# EAGLE design flight controller with pcb frame (EAGLE 9.3.2)
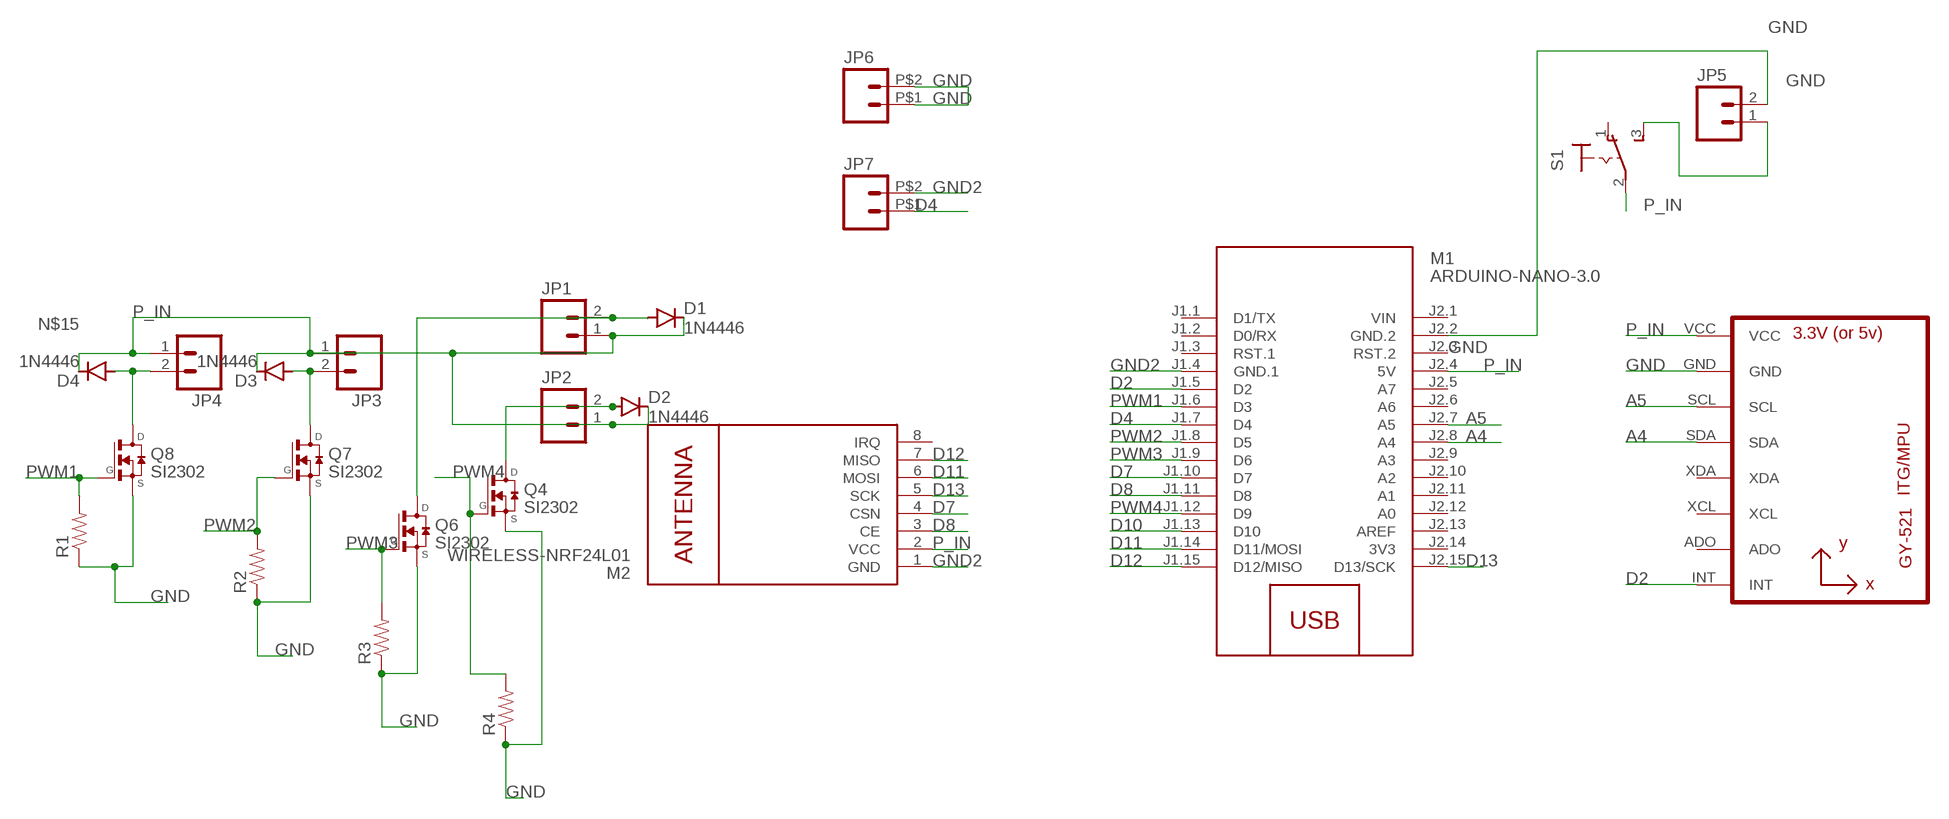
[diagram p0: schematic, sheet 1]

## Parts
D1  1N4446  [DO35-10]
D2  1N4446  [DO35-10]
D3  1N4446  [DO35-10]
D4  1N4446  [DO35-10]
JP1  M021X02_NO_SILK  [1X02_NO_SILK]
JP2  M021X02_NO_SILK  [1X02_NO_SILK]
JP3  M021X02_NO_SILK  [1X02_NO_SILK]
JP4  M021X02_NO_SILK  [1X02_NO_SILK]
JP5  M02PTH  [1X02]
JP6  M02PTH2  [1X02_BIG]
JP7  M02PTH2  [1X02_BIG]
M1  ARDUINO-NANO-3.0  [ARDUINO-NANO-3.0]
M2  WIRELESS-NRF24L01  [WIRELESS-NRF24L01]
Q4  SI2302  [SOT23]
Q6  SI2302  [SOT23]
Q7  SI2302  [SOT23]
Q8  SI2302  [SOT23]
R1  RESISTORAXIAL-0.3  [AXIAL-0.3]
R2  RESISTORAXIAL-0.3  [AXIAL-0.3]
R3  RESISTORAXIAL-0.3  [AXIAL-0.3]
R4  RESISTORAXIAL-0.3  [AXIAL-0.3]
S1  M9040P  [M9040P]
U1  GY-521MPU6050  [GY-521]

## Nets
A4: M1.J2.8(A4) U1.SDA
A5: M1.J2.7(A5) U1.SCL
D2: M1.J1.5(D2) U1.INT
D4: JP7.P$1 M1.J1.7(D4)
D7: M1.J1.10(D7) M2.4(CSN)
D8: M1.J1.11(D8) M2.3(CE)
D10: M1.J1.13(D10)
D11: M1.J1.14(D11/MOSI) M2.6(MOSI)
D12: M1.J1.15(D12/MISO) M2.7(MISO)
D13: M1.J2.15(D13/SCK) M2.5(SCK)
GND: JP5.2 JP6.P$1 JP6.P$2 M1.J2.2(GND.2) Q4.2(S) Q6.2(S) Q7.2(S) Q8.2(S) R1.P$1 R2.P$1 R3.P$1 R4.P$1 U1.GND
GND2: JP7.P$2 M1.J1.4(GND.1) M2.1(GND)
N$2: JP5.1 S1.3(S)
N$12: D1.A JP1.2 Q6.3(D)
N$13: D3.A JP3.2 Q7.3(D)
N$14: D2.A JP2.2 Q4.3(D)
N$15: D4.A JP4.2 Q8.3(D)
P_IN: D1.C D2.C D3.C D4.C JP1.1 JP2.1 JP3.1 JP4.1 M1.J2.4(5V) M2.2(VCC) S1.2(P) U1.VCC
PWM1: M1.J1.6(D3) Q8.1(G) R1.P$2
PWM2: M1.J1.8(D5) Q7.1(G) R2.P$2
PWM3: M1.J1.9(D6) Q6.1(G) R3.P$2
PWM4: M1.J1.12(D9) Q4.1(G) R4.P$2
Unconnected: M1.J1.1(D1/TX) M1.J1.2(D0/RX) M1.J1.3(RST.1) M1.J2.3(RST.2) M1.J2.5(A7) M1.J2.6(A6) M1.J2.9(A3) M1.J2.10(A2) M1.J2.11(A1) M1.J2.12(A0) M1.J2.13(AREF) M2.8(IRQ) S1.1(O) U1.ADO U1.XCL U1.XDA

## Power pins joined to a net without a drawn wire
3V3: M1.J2.14(3V3)
VIN: M1.J2.1(VIN)

## Library data of the parts
D1-D4 = diode:1N4446: DIODE high speed (Philips)
JP1-JP7 = SparkFun:M02: Header 2 Standard 2-pin 0.1" header. Use with straight break away headers (SKU : PRT-00116), right angle break away headers (PRT-00553), swiss pins (PRT-00743), machine pins (PRT-00117), and female headers (PRT-00115). Molex polarized connector foot print use with SKU : PRT-08233 with associated crimp pins and housings.
M1 = diy-modules:ARDUINO-NANO-3.0: Arduino Nano 3.0 and compatible devices More details available here: https://www.arduino.cc/en/Main/ArduinoBoardNano Click here to find device on ebay.com <http://www.ebay.com/sch/arduino+nano>
M2 = diy-modules:WIRELESS-NRF24L01: 2.4 GHz Wireless Module based on NRF24L01 chip More details available here: http://www.electrodragon.com/w/NRF24L01 Click here to find device on ebay.com <http://www.ebay.com/sch/nrf24l01+arduino>
Q4 Q6-Q8 = transistor-fet:SI2302: MOSFET N-Channel 20 V (D-S)
R1-R4 = SparkFun:RESISTOR: Resistor Basic schematic elements and footprints for 0603, 1206, and PTH resistors.
S1 = switch:M9040P: TOGGLE SWITCH Marquardt
U1 = gy-521:GY-521

## Board
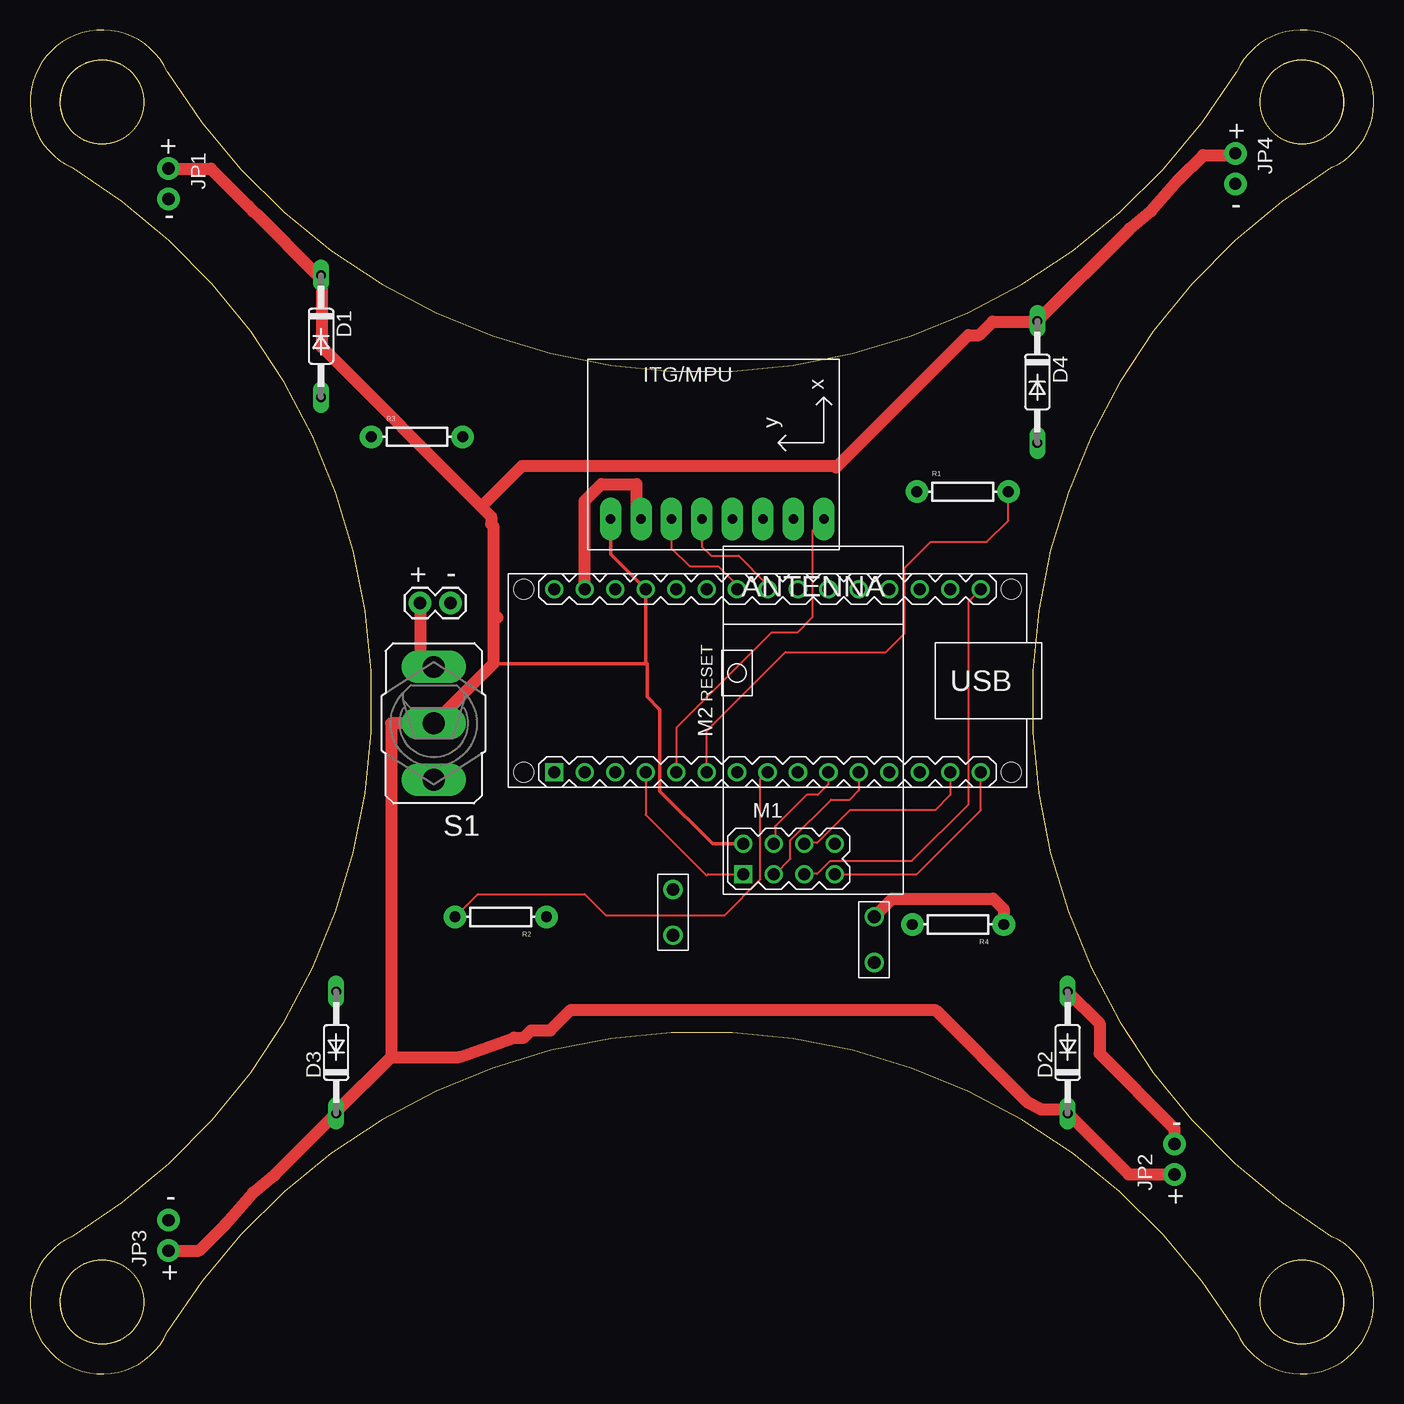
[diagram p1: board, top side]
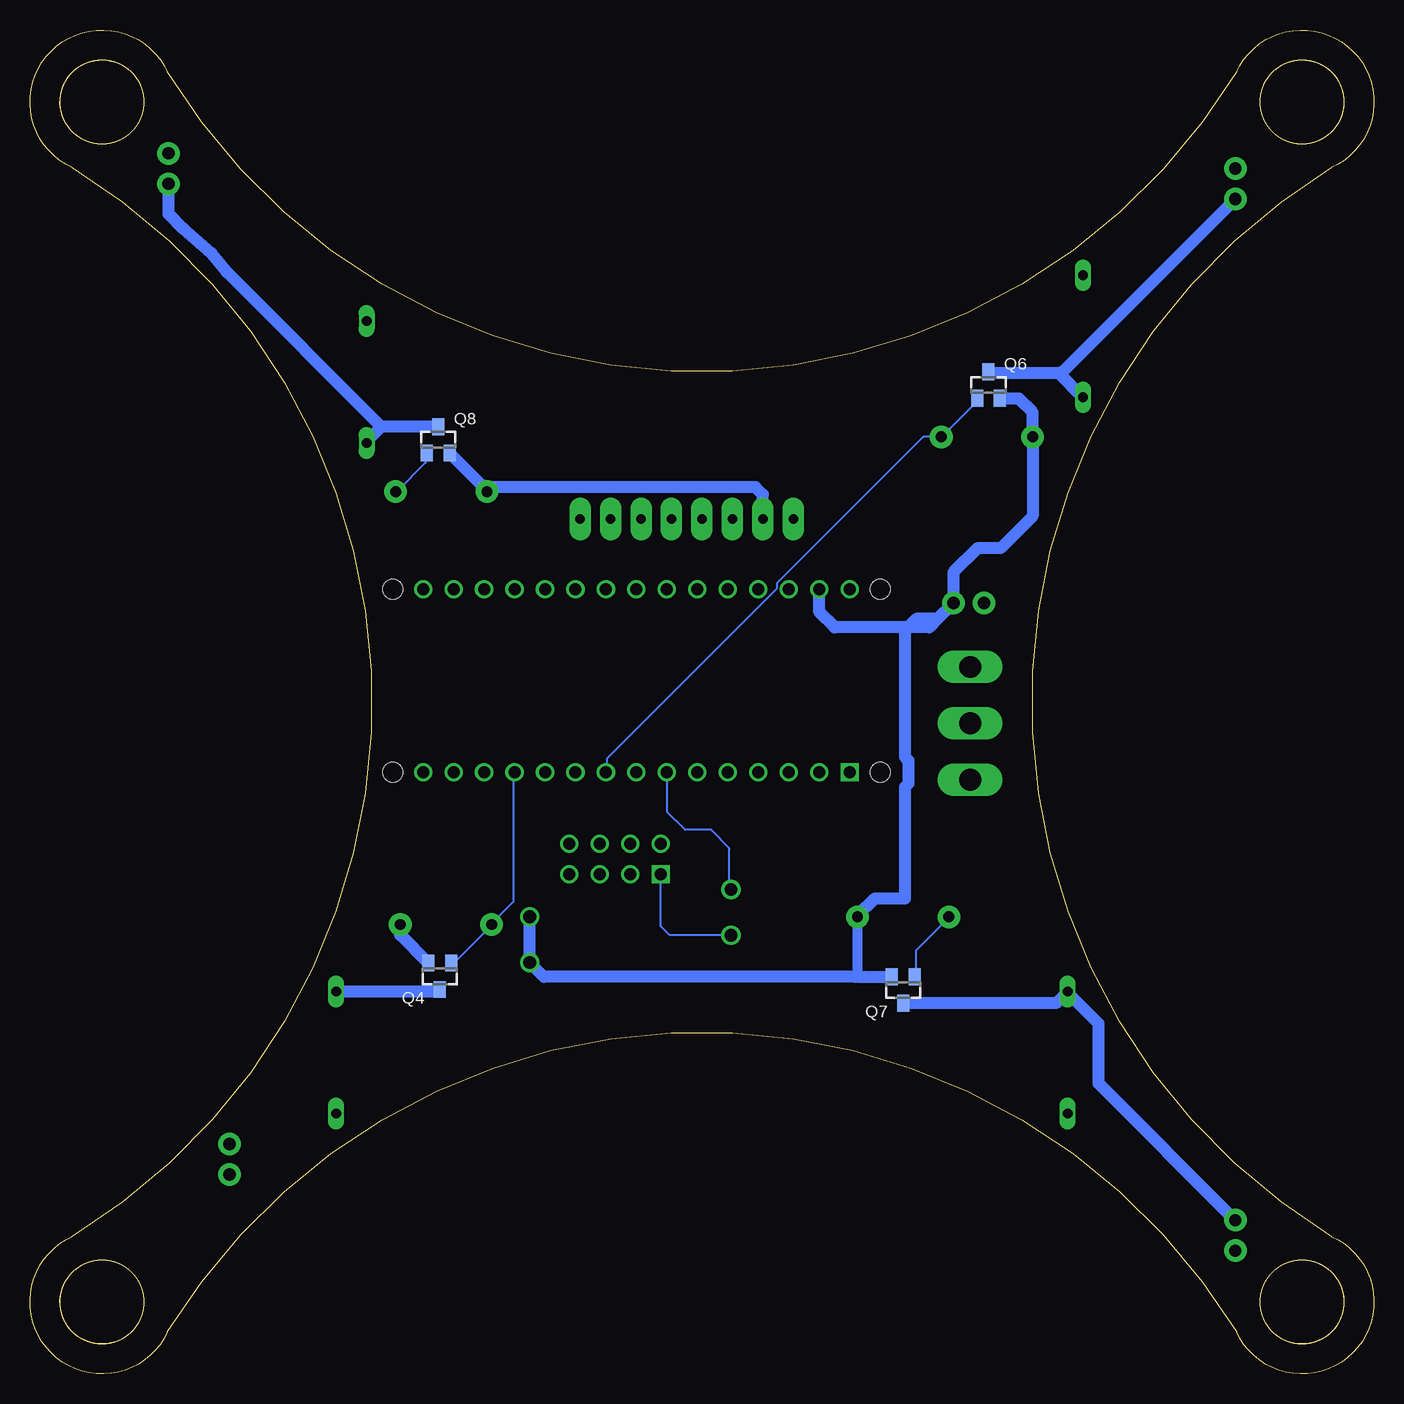
[diagram p2: board, bottom side, seen from below]

Size 112 x 112 mm. Coordinates in mm from the lower left corner, seen from the top.
Outline: 11.45,108.5 arc221 3.5,100.54
Outline: 9.18,107.46 arc221 4.54,102.82
Outline: 108.5,100.54 arc221 100.54,108.5
Outline: 107.46,102.82 arc221 102.82,107.46
Outline: 100.54,3.5 arc221 108.5,11.45
Outline: 102.82,4.54 arc221 107.46,9.18
Outline: 3.5,11.45 arc221 11.45,3.5
Outline: 4.54,9.18 arc221 9.18,4.54
Outline: 11.45,108.5 arc117 100.54,108.5
Outline: 108.5,100.54 arc221 100.54,108.5
Outline: 108.5,100.54 arc117 108.5,11.45
Outline: 3.5,11.45 arc117 3.5,100.54
Outline: 11.45,108.5 arc221 3.5,100.54
Outline: 100.54,3.5 arc221 108.5,11.45
Outline: 100.54,3.5 arc117 11.45,3.5
Outline: 3.5,11.45 arc221 11.45,3.5
Outline: circle at 6.37,102.52 radius 0
Outline: circle at 106,106 radius 3.5
Outline: circle at 6,106 radius 3.5
Outline: circle at 106,6 radius 3.5
Outline: circle at 6,6 radius 3.5
Copper layers (1*16): Top 0.035mm / dielectric 1.5mm / Bottom 0.035mm
Design rules "default": minimum track width 6mil, minimum drill 0.35mm, track to track 6mil, track to pad 6mil, pad to pad 6mil, via to via 6mil, smd to smd 6mil, copper to edge 40mil, drill to drill 6mil, minimum pad ring 10mil, minimum via ring 8mil, stop-mask expansion 4mil, vias tented up to drill 0mil, thermal gap 10mil

### Footprints (pad centres in the part's own frame; a part is rotated, then mirrored left to right if it is on the bottom)
DO35-10 = drill 0.813 long: A 5.08,0; C -5.08,0
1X02_NO_SILK = drill 1.016 pad 1.88: 1 0,0; 2 2.54,0
1X02 = drill 1.016 pad 1.88: 1 0,0; 2 2.54,0
1X02_BIG = drill 1.067: P$1 0,0; P$2 3.81,0
ARDUINO-NANO-3.0 = drill 1 square: J1.1 17.78,7.62 | drill 1: J1.2 15.24,7.62; J1.3 12.7,7.62; J1.4 10.16,7.62; J1.5 7.62,7.62; J1.6 5.08,7.62; J1.7 2.54,7.62; J1.8 0,7.62; J1.9 -2.54,7.62; J1.10 -5.08,7.62; J1.11 -7.62,7.62; J1.12 -10.16,7.62; J1.13 -12.7,7.62; J1.14 -15.24,7.62; J1.15 -17.78,7.62; J2.1 17.78,-7.62; J2.2 15.24,-7.62; J2.3 12.7,-7.62; J2.4 10.16,-7.62; J2.5 7.62,-7.62; J2.6 5.08,-7.62; J2.7 2.54,-7.62; J2.8 0,-7.62; J2.9 -2.54,-7.62; J2.10 -5.08,-7.62; J2.11 -7.62,-7.62; J2.12 -10.16,-7.62; J2.13 -12.7,-7.62; J2.14 -15.24,-7.62; J2.15 -17.78,-7.62 | hole 1.651: -20.32,7.62; -20.32,-7.62; 20.32,-7.62; 20.32,7.62
WIRELESS-NRF24L01 = drill 1 square: 1 -12.7,6.35 | drill 1: 2 -10.16,6.35; 3 -12.7,3.81; 4 -10.16,3.81; 5 -12.7,1.27; 6 -10.16,1.27; 7 -12.7,-1.27; 8 -10.16,-1.27
SOT23 = smd 1 x 1.4: 1 -0.95,-1.1; 2 0.95,-1.1; 3 0,1.1
AXIAL-0.3 = drill 0.9 pad 1.88: P$1 -3.81,0; P$2 3.81,0
M9040P = drill 1.803 long: 1 0,4.699; 2 0,0; 3 0,-4.699
GY-521 = drill 0.8 pad 1.778 long: ADO -8.89,-6.35; GND -8.89,6.35; INT -8.89,-8.89; SCL -8.89,3.81; SDA -8.89,1.27; VCC -8.89,8.89; XCL -8.89,-3.81; XDA -8.89,-1.27

### Placement (x,y rotation side)
D1  24.25,86.48 270 top
D2  86.48,26.79 90 top
D3  25.52,26.79 90 top
D4  83.94,82.67 270 top
JP1  11.55,100.45 270 top
JP2  95.37,16.63 90 top
JP3  11.55,10.28 90 top
JP4  100.45,101.72 270 top
JP5  32.5,64.25 0 top
JP6  70.35,38.09 270 top
JP7  53.59,40.38 270 top
M1  61.46,57.78 180 top
M2  65.78,54.35 90 top
Q4  77.84,33.14 180 bottom
Q6  32.12,82.41 0 bottom
Q7  39.23,32 180 bottom
Q8  77.97,77.84 0 bottom
R1  77.72,73.52 0 top
R2  39.23,38.09 180 top
R3  32.25,78.1 0 top
R4  77.33,37.46 180 top
S1  33.65,54.22 180 top
U1  57.27,80.13 90 top

### Tracks (layer width: path | path; a pad name or v marks a point on that pad's centre or on a via)
A4
  Top 0.152: M1.J2.8 61.33,65.45 61.33,65.9 59.05,68.19 56.76,68.19 56,68.95 U1.SDA
A5
  Top 0.152: M1.J2.7 58.89,65.45 58.89,65.75 57.34,67.3 54.98,67.3 53.46,68.83 U1.SCL
D2
  Top 0.152: M1.J1.5 53.86,50.21 53.86,53.86 61.78,61.78 63.94,61.78 65.21,63.05 65.21,70.29 U1.INT
D4
  Bottom 0.152: M1.J1.7 58.89,50.05 58.89,46.83 57.4,45.33 55.24,45.33 53.71,43.81 53.71,40.5 JP7.P$1
D7
  Top 0.152: M2.4 62.09,44.26 62.09,45.64 64.71,48.25 65.65,48.25 66.54,49.14 M1.J1.10
D8
  Top 0.152: M1.J1.11 69.08,48.63 68.32,47.87 66.77,47.87 63.36,44.47 63.36,42.92 62.09,41.65 M2.3
D11
  Top 0.152: M2.6 64.53,44.26 65.6,44.26 68.32,46.98 75.43,46.98 76.7,48.25 M1.J1.14
D12
  Top 0.152: M2.7 73.91,41.65 79.24,46.98 M1.J1.15
D13
  Top 0.152: M2.5 64.53,41.67 65.6,41.67 66.69,42.77 73.5,42.77 78.22,47.49 78.22,51.66 78.25,51.68 78.25,64.38 79.16,65.29 M1.J2.15
GND
  Top 1: M1.J2.2 46.22,72.76 47.62,74.16 50.54,74.16 50.54,71.62 U1.GND | JP6.P$1 71.87,39.62 80.26,39.62 81.14,38.73 R4.P$1
  Bottom 0.152: 35.12,64.23 JP5.2 | 73.98,73.52 74.07,73.61 76.88,76.42 76.88,76.72 Q8.2 | R2.P$1 43.04,38.17 42.96,38.26 41.83,39.39 39.08,39.39 39.08,39.62 | 78.4,34.21 78.71,34.21 Q4.2 | 73.98,73.4 73.98,73.52 | 73.98,73.52 R1.P$1
  Bottom 0.813: R2.P$1 43.04,33.25 43.2,33.1
  Bottom 1: 36.38,62.92 37.08,62.22 44.95,62.22 46.22,63.49 M1.J2.2 | JP5.2 35.04,66.79 33.01,68.83 31.11,68.83 28.44,71.49 R3.P$1 28.44,80.13 29.58,81.27 31.13,81.27 Q6.2 | Q8.2 73.98,73.7 73.98,73.4 | Q4.2 81.14,36.59 R4.P$1 | 42.96,38.26 41.6,39.62 39.08,39.62 39.08,48.9 38.8,49.19 38.8,51.13 39.08,51.41 39.08,61.97 38.13,62.92 36.38,62.92 | U1.GND 50.92,73.27 51.55,73.91 73.78,73.91 74.07,73.61 | JP6.P$1 JP6.P$2 69.16,33.1 43.2,33.1 | 36.38,62.92 35.12,64.18 35.12,64.23 | 43.04,33.25 42.89,33.1 Q7.2
GND2
  Top 0.152: M1.J1.4 51.3,46.6 56.38,41.52 56.51,41.65 M2.1
  Bottom 0.152: JP7.P$2 58.67,36.57 59.43,37.33 M2.1
N$2
  Top 1: JP5.1 32.5,60.06 S1.3
N$12
  Bottom 1: D1.A 26.28,83.43 | Q6.3 32.04,83.43 26.28,83.43 | JP1.2 26.03,83.43 26.28,83.43
N$13
  Bottom 0.152: Q7.3 39.23,31 26.28,31 25.52,31.77 D3.A
  Bottom 1: 25.52,31.77 22.94,29.19 22.94,24.21 JP3.2 | D3.A 26.49,30.9 Q7.3
N$14
  Top 1: D2.A 89.14,29.21 89.14,26.69 95.37,20.45 JP2.2
  Bottom 1: Q4.3 78.01,31.87 D2.A
N$15
  Bottom 0.152: 82.67,78.86 78.1,78.86 Q8.3 | D4.A 82.67,78.86 | 82.67,78.86 82.73,78.92 100.35,96.54 100.35,99.13 JP4.2
  Bottom 1: Q8.3 82.71,78.94 | 82.71,78.94 82.73,78.92 83.94,77.72 D4.A | JP4.2 100.45,96.68 99.22,95.45 96.88,93.41 95.62,91.85 82.71,78.94
P_IN
  Top 0.152: 100.21,101.58 100.35,101.72 JP4.1 | 23.87,91.66 24.15,91.66 D1.C | S1.2 34.34,54.92 | 38.43,70.82 38.62,70.63 | 25.52,21.84 D3.C | 83.81,87.7 83.89,87.7 D4.C | 67.17,75.56 67.24,75.62 | 39,59 38.62,59.2
  Top 0.3: 38.62,59.2 51.43,59.2 | U1.VCC 48.38,68.32 M1.J2.4 51.3,59.33 51.43,59.2 | 51.43,59.2 51.43,56.44 52.5,55.36 52.5,48.58 56.89,44.19 M2.2
  Top 1: JP1.1 15.08,100.45 18.2,97.32 18.59,96.88 18.88,96.64 23.87,91.66 | D1.C 24.3,91.51 24.3,85.59 37.61,72.28 | 37.61,72.28 38.43,71.45 38.43,70.82 | 38.62,70.63 38.62,62.73 | 38.62,62.73 38.62,59.2 34.34,54.92 | 37.61,72.28 41.01,75.68 67.05,75.68 67.17,75.56 | 67.24,75.62 78.2,86.58 79.1,86.58 80.22,87.7 83.81,87.7 | 100.21,101.58 97.77,101.58 95.74,99.55 93.41,96.88 91.63,95.44 D4.C | S1.2 30.09,54.22 30.09,26.41 | 30.09,26.41 25.52,21.84 | JP3.1 14.09,10.28 16.26,12.45 18.59,15.11 20.37,16.56 D3.C | 30.09,26.41 35.77,26.41 40.34,28.03 41.16,28.03 41.76,28.63 43.36,28.63 45.08,30.34 75.43,30.34 83.08,22.7 84.25,22.04 86.15,22.04 D2.C 91.56,16.63 JP2.1 | 38.62,62.73 38.95,63.05
PWM1
  Top 0.152: M1.J1.6 56.38,53.59 62.95,60.15 71.33,60.15 72.89,61.71 72.89,67.17 75.05,69.33 79.75,69.33 81.53,71.11 R1.P$2
  Bottom 0.152: Q8.1 79.01,76.72 79.01,75.96 81.45,73.52 R1.P$2
PWM2
  Top 0.152: M1.J1.8 61.33,50.05 60.88,49.6 60.88,41.22 57.88,38.22 48,38.22 46.22,40 37.33,40 R2.P$2
  Bottom 0.152: Q7.1 38.17,33.14 38.17,35.27 35.42,38.02 R2.P$2
PWM3
  Bottom 0.152: Q6.1 33.14,81.3 33.14,80.99 36.03,78.1 R3.P$2 37.56,78.1 49.75,65.9 49.75,65.45 63.92,51.27 63.92,50.21 M1.J1.9
PWM4
  Bottom 0.152: Q4.1 76.88,34.36 76.57,34.36 73.52,37.41 R4.P$2 73.52,37.56 71.7,39.39 71.7,50.05 M1.J1.12

### Text on the board
tPlace: + | + | - | - | + | - | - | - | + | +